# EAGLE schematic mopho (EAGLE 7.6.0)
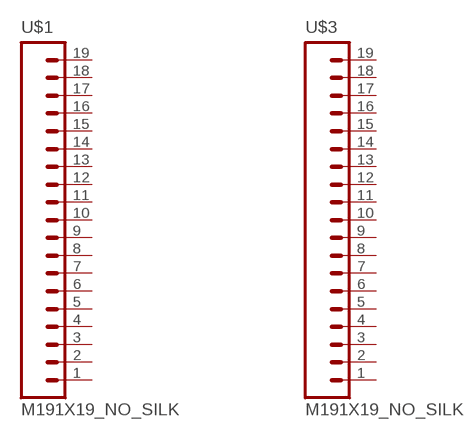
[diagram p0: schematic, sheet 1]

## Parts
U$1  M191X19_NO_SILK  [1X19_NO_SILK]
U$3  M191X19_NO_SILK  [1X19_NO_SILK]
Unconnected: U$1.1 U$1.2 U$1.3 U$1.4 U$1.5 U$1.6 U$1.7 U$1.8 U$1.9 U$1.10 U$1.11 U$1.12 U$1.13 U$1.14 U$1.15 U$1.16 U$1.17 U$1.18 U$1.19 U$3.1 U$3.2 U$3.3 U$3.4 U$3.5 U$3.6 U$3.7 U$3.8 U$3.9 U$3.10 U$3.11 U$3.12 U$3.13 U$3.14 U$3.15 U$3.16 U$3.17 U$3.18 U$3.19

## Library data of the parts
U$1 U$3 = SparkFun-Connectors:M19: 1x19 .1" header